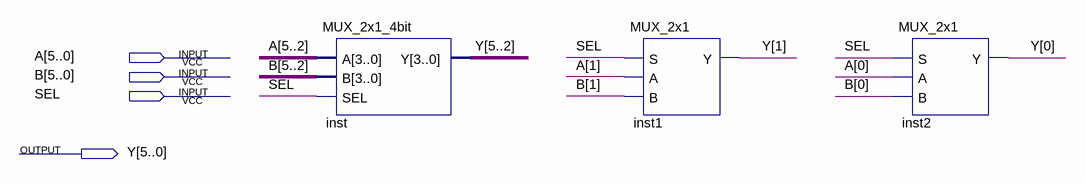
[diagram p0: schematic sheet]
// Quartus schematic MUX_2x1_6bit.bdf as structural Verilog: 3 symbols, 4 pins
module MUX_2x1_6bit (
  input  [5:0] A,
  input  [5:0] B,
  input  SEL,
  output [5:0] Y
);

  MUX_2x1_4bit inst (.A(A[5:2]), .B(B[5:2]), .SEL(SEL), .Y(Y[5:2]));
  MUX_2x1 inst1 (.S(SEL), .A(A[1]), .B(B[1]), .Y(Y[1]));
  MUX_2x1 inst2 (.S(SEL), .A(A[0]), .B(B[0]), .Y(Y[0]));
endmodule
